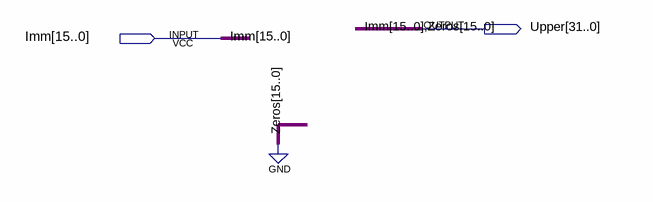
[diagram p0: schematic sheet]
// Quartus schematic Upper2.bdf as structural Verilog: 0 symbols, 2 pins
module Upper2 (
  input  [15:0] Imm,
  output [31:0] Upper
);


  assign Upper = {Imm, {16{1'b0}}};
endmodule
